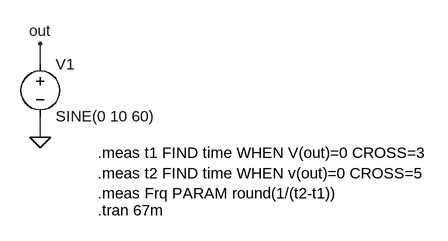
[diagram p0: schematic MEAS TRAN Frequencia.asc]
MEAS TRAN Frequencia.asc, the LTspice schematic file:
Version 4
SHEET 1 880 680
WIRE 0 128 0 96
WIRE 0 240 0 208
FLAG 0 240 0
FLAG 0 96 out
SYMBOL voltage 0 112 R0
WINDOW 123 0 0 Left 0
WINDOW 39 0 0 Left 0
SYMATTR InstName V1
SYMATTR Value SINE(0 10 60)
TEXT 88 352 Left 2 !.tran 67m
TEXT 88 264 Left 2 !.meas t1 FIND time WHEN V(out)=0 CROSS=3\n.meas t2 FIND time WHEN v(out)=0 CROSS=5\n.meas Frq PARAM round(1/(t2-t1))

The netlist it stands for:
* MEAS TRAN Frequencia.asc
V1 out 0 SINE(0 10 60)
.tran 67m
.meas t1 FIND time WHEN V(out)=0 CROSS=3
.meas t2 FIND time WHEN v(out)=0 CROSS=5
.meas Frq PARAM round(1/(t2-t1))
.backanno
.end